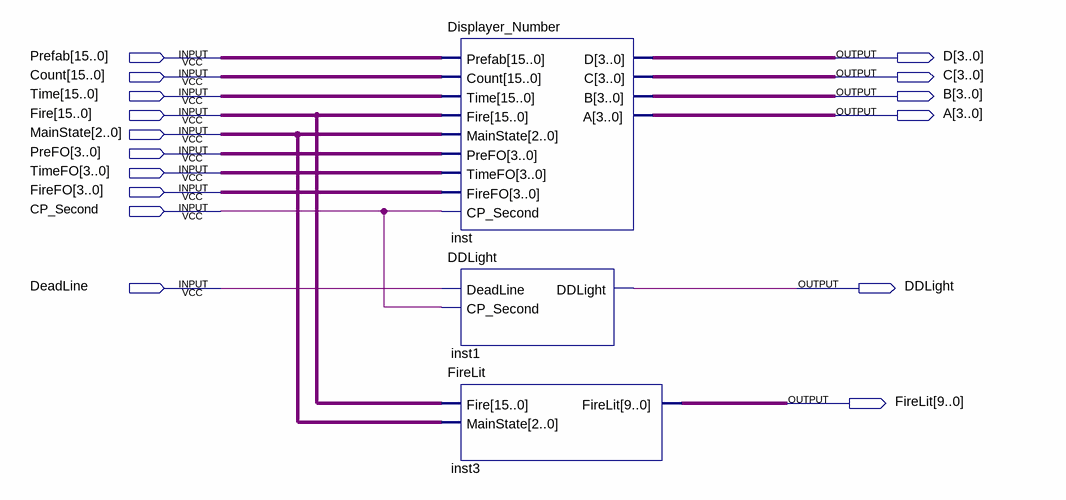
[diagram p0: schematic sheet]
// Quartus schematic Displayer.bdf as structural Verilog: 3 symbols, 16 pins
module Displayer (
  input  [15:0] Prefab,
  input  [15:0] Count,
  input  [15:0] Time,
  input  [15:0] Fire,
  input  [2:0] MainState,
  input  [3:0] PreFO,
  input  [3:0] TimeFO,
  input  [3:0] FireFO,
  input  CP_Second,
  input  DeadLine,
  output [3:0] D,
  output [3:0] C,
  output [3:0] B,
  output [3:0] A,
  output DDLight,
  output [9:0] FireLit
);

  Displayer_Number inst (
    .Prefab(Prefab), .Count(Count), .Time(Time), .Fire(Fire), .MainState(MainState), .PreFO(PreFO),
    .TimeFO(TimeFO), .FireFO(FireFO), .CP_Second(CP_Second), .D(D), .C(C), .B(B), .A(A));
  DDLight inst1 (.DeadLine(DeadLine), .CP_Second(CP_Second), .DDLight(DDLight));
  FireLit inst3 (.Fire(Fire), .MainState(MainState), .FireLit(FireLit));
endmodule
